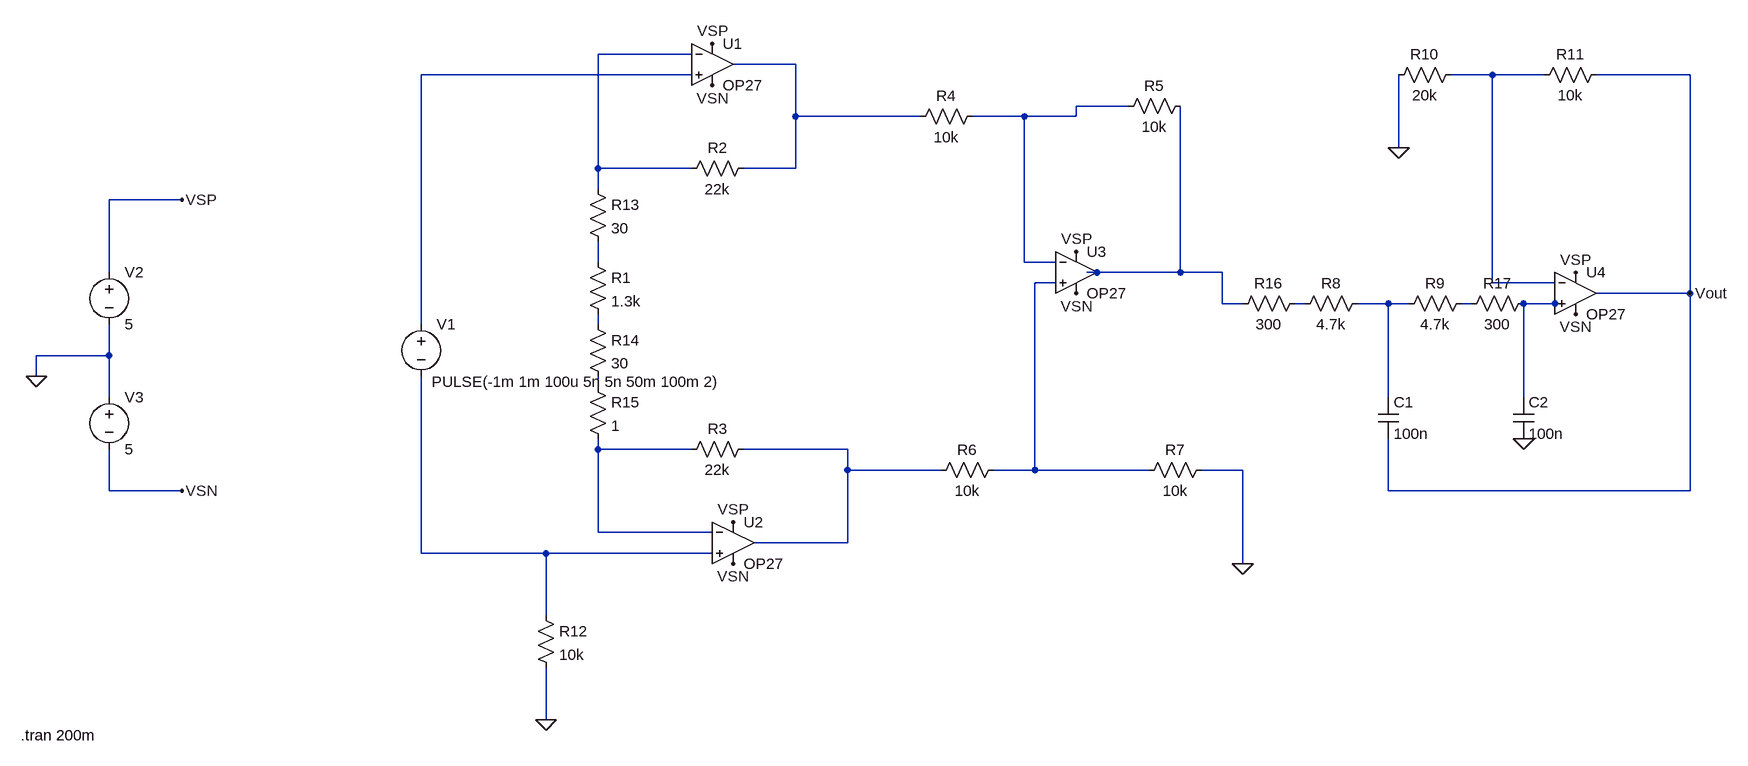
[diagram p0: schematic Bonus - Cerinta 5.2 - Refacere cerinta 4.asc]
Bonus - Cerinta 5.2 - Refacere cerinta 4.asc, the LTspice schematic file:
Version 4
SHEET 1 2448 824
WIRE 864 -240 720 -240
WIRE 1024 -224 928 -224
WIRE 864 -208 448 -208
WIRE 2096 -208 2032 -208
WIRE 2176 -208 2096 -208
WIRE 2400 -208 2256 -208
WIRE 1536 -160 1456 -160
WIRE 1024 -144 1024 -224
WIRE 1216 -144 1024 -144
WIRE 1376 -144 1296 -144
WIRE 1456 -144 1456 -160
WIRE 1456 -144 1376 -144
WIRE 1952 -96 1952 -208
WIRE 720 -64 720 -240
WIRE 864 -64 720 -64
WIRE 1024 -64 1024 -144
WIRE 1024 -64 944 -64
WIRE 720 -32 720 -64
WIRE 80 -16 -32 -16
WIRE 720 80 720 48
WIRE 1376 80 1376 -144
WIRE 1424 80 1376 80
WIRE -32 96 -32 -16
WIRE 1488 96 1472 96
WIRE 1616 96 1616 -160
WIRE 1616 96 1488 96
WIRE 1680 96 1616 96
WIRE 1424 112 1392 112
WIRE 2096 112 2096 -208
WIRE 2192 112 2096 112
WIRE 2400 128 2400 -208
WIRE 2400 128 2256 128
WIRE 1680 144 1680 96
WIRE 1712 144 1680 144
WIRE 1808 144 1792 144
WIRE 1936 144 1888 144
WIRE 1968 144 1936 144
WIRE 2064 144 2048 144
WIRE 2192 144 2144 144
WIRE 2208 144 2192 144
WIRE 448 176 448 -208
WIRE 720 176 720 160
WIRE -32 224 -32 176
WIRE -32 224 -144 224
WIRE -144 256 -144 224
WIRE 720 272 720 256
WIRE -32 288 -32 224
WIRE 1936 288 1936 144
WIRE 2144 288 2144 144
WIRE 720 368 720 352
WIRE 864 368 720 368
WIRE 1104 368 944 368
WIRE 1104 400 1104 368
WIRE 1248 400 1104 400
WIRE 1392 400 1392 112
WIRE 1392 400 1328 400
WIRE 1568 400 1392 400
WIRE 1712 400 1648 400
WIRE -32 432 -32 368
WIRE 80 432 -32 432
WIRE 1936 432 1936 352
WIRE 2400 432 2400 128
WIRE 2400 432 1936 432
WIRE 720 496 720 368
WIRE 896 496 720 496
WIRE 1104 512 1104 400
WIRE 1104 512 960 512
WIRE 448 528 448 256
WIRE 640 528 448 528
WIRE 896 528 640 528
WIRE 1712 544 1712 400
WIRE 640 624 640 528
WIRE 640 784 640 704
FLAG -144 256 0
FLAG 80 -16 VSP
FLAG 80 432 VSN
FLAG 640 784 0
FLAG 1712 544 0
FLAG 1952 -96 0
FLAG 2144 352 0
FLAG 2224 96 VSP
FLAG 2224 160 VSN
FLAG 1456 64 VSP
FLAG 1456 128 VSN
FLAG 896 -256 VSP
FLAG 896 -192 VSN
FLAG 2400 128 Vout
FLAG 928 480 VSP
FLAG 928 544 VSN
SYMBOL voltage -32 80 R0
SYMATTR InstName V2
SYMATTR Value 5
SYMBOL voltage -32 272 R0
SYMATTR InstName V3
SYMATTR Value 5
SYMBOL voltage 448 160 R0
WINDOW 3 16 104 Left 2
WINDOW 123 16 132 Left 2
WINDOW 39 0 0 Left 2
SYMATTR Value PULSE(-1m 1m 100u 5n 5n 50m 100m 2)
SYMATTR InstName V1
SYMBOL res 624 608 R0
SYMATTR InstName R12
SYMATTR Value 10k
SYMBOL res 960 352 R90
WINDOW 0 0 56 VBottom 2
WINDOW 3 32 56 VTop 2
SYMATTR InstName R3
SYMATTR Value 22k
SYMBOL res 960 -80 R90
WINDOW 0 0 56 VBottom 2
WINDOW 3 32 56 VTop 2
SYMATTR InstName R2
SYMATTR Value 22k
SYMBOL res 704 64 R0
SYMATTR InstName R1
SYMATTR Value 1.3k
SYMBOL res 1312 -160 R90
WINDOW 0 0 56 VBottom 2
WINDOW 3 32 56 VTop 2
SYMATTR InstName R4
SYMATTR Value 10k
SYMBOL res 1632 -176 R90
WINDOW 0 0 56 VBottom 2
WINDOW 3 32 56 VTop 2
SYMATTR InstName R5
SYMATTR Value 10k
SYMBOL res 1344 384 R90
WINDOW 0 0 56 VBottom 2
WINDOW 3 32 56 VTop 2
SYMATTR InstName R6
SYMATTR Value 10k
SYMBOL res 1664 384 R90
WINDOW 0 0 56 VBottom 2
WINDOW 3 32 56 VTop 2
SYMATTR InstName R7
SYMATTR Value 10k
SYMBOL res 1904 128 R90
WINDOW 0 0 56 VBottom 2
WINDOW 3 32 56 VTop 2
SYMATTR InstName R8
SYMATTR Value 4.7k
SYMBOL cap 1920 288 R0
SYMATTR InstName C1
SYMATTR Value 100n
SYMBOL cap 2128 288 R0
SYMATTR InstName C2
SYMATTR Value 100n
SYMBOL res 2048 -224 R90
WINDOW 0 0 56 VBottom 2
WINDOW 3 32 56 VTop 2
SYMATTR InstName R10
SYMATTR Value 20k
SYMBOL res 2272 -224 R90
WINDOW 0 0 56 VBottom 2
WINDOW 3 32 56 VTop 2
SYMATTR InstName R11
SYMATTR Value 10k
SYMBOL res 704 -48 R0
SYMATTR InstName R13
SYMATTR Value 30
SYMBOL res 704 160 R0
SYMATTR InstName R14
SYMATTR Value 30
SYMBOL res 704 256 R0
SYMATTR InstName R15
SYMATTR Value 1
SYMBOL res 1808 128 R90
WINDOW 0 0 56 VBottom 2
WINDOW 3 32 56 VTop 2
SYMATTR InstName R16
SYMATTR Value 300
SYMBOL res 2064 128 R90
WINDOW 0 0 56 VBottom 2
WINDOW 3 32 56 VTop 2
SYMATTR InstName R9
SYMATTR Value 4.7k
SYMBOL res 2160 128 R90
WINDOW 0 0 56 VBottom 2
WINDOW 3 32 56 VTop 2
SYMATTR InstName R17
SYMATTR Value 300
SYMBOL Opamps\\OP27 896 -288 R0
SYMATTR InstName U1
SYMBOL Opamps\\OP27 928 448 R0
SYMATTR InstName U2
SYMBOL Opamps\\OP27 1456 32 R0
SYMATTR InstName U3
SYMBOL Opamps\\OP27 2224 64 R0
SYMATTR InstName U4
TEXT -168 808 Left 2 !.tran 200m

The netlist it stands for:
* Bonus - Cerinta 5.2 - Refacere cerinta 4.asc
V2 VSP 0 5
V3 0 VSN 5
V1 N003 N017 PULSE(-1m 1m 100u 5n 5n 50m 100m 2)
R12 N017 0 10k
R3 N016 N015 22k
R2 N002 N001 22k
R1 N006 N013 1.3k
R4 N005 N002 10k
R5 N007 N005 10k
R6 N008 N016 10k
R7 0 N008 10k
R8 N010 N009 4.7k
C1 N010 Vout 100n
C2 N012 0 100n
R10 N004 0 20k
R11 Vout N004 10k
R13 N001 N006 30
R14 N013 N014 30
R15 N014 N015 1
R16 N009 N007 300
R9 N011 N010 4.7k
R17 N012 N011 300
XU1 N003 N001 VSP VSN N002 OP27  ; pins In+ In- V+ V- OUT
XU2 N017 N015 VSP VSN N016 OP27  ; pins In+ In- V+ V- OUT
XU3 N008 N005 VSP VSN N007 OP27  ; pins In+ In- V+ V- OUT
XU4 N012 N004 VSP VSN Vout OP27  ; pins In+ In- V+ V- OUT
.tran 200m
.lib ADI.lib
.backanno
.end